# Altium schematic sheet TopSheet.SchDoc
size 431 x 279 mm; SheetNumber: 1; SheetTotal: 4; SheetTitle: Top
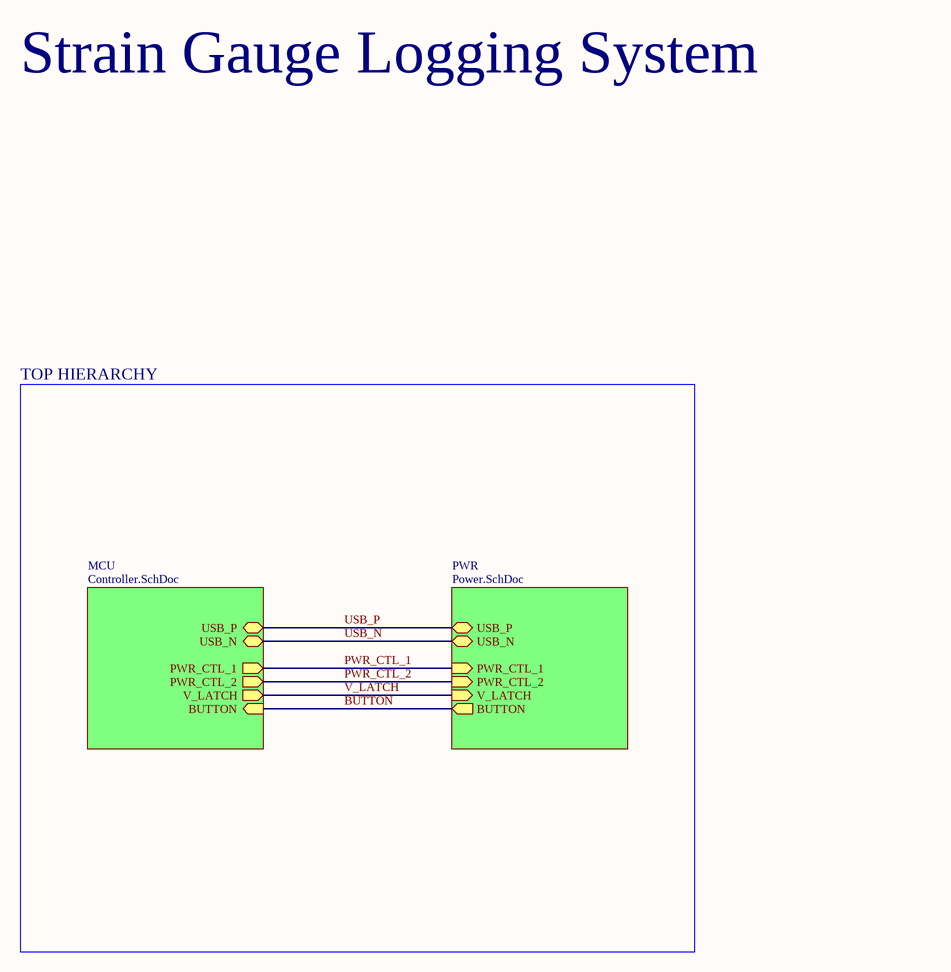
[diagram p0: TopSheet.SchDoc]

## Sub-sheets
MCU = Controller.SchDoc: USB_N (bidir), USB_P (bidir), PWR_CTL_2 (out), PWR_CTL_1 (out), V_LATCH (out), BUTTON (in)
PWR = Power.SchDoc: USB_P (bidir), BUTTON (out), USB_N (bidir), PWR_CTL_1 (in), PWR_CTL_2 (in), V_LATCH (in)

## Nets
BUTTON: sheet MCU/BUTTON, sheet PWR/BUTTON
PWR_CTL_1: sheet MCU/PWR_CTL_1, sheet PWR/PWR_CTL_1
PWR_CTL_2: sheet MCU/PWR_CTL_2, sheet PWR/PWR_CTL_2
USB_N: sheet MCU/USB_N, sheet PWR/USB_N
USB_P: sheet MCU/USB_P, sheet PWR/USB_P
V_LATCH: sheet MCU/V_LATCH, sheet PWR/V_LATCH

## Notes on the sheet
- Strain Gauge Logging System
- TOP HIERARCHY
- Variant name
- Number:
- Date:
- Revision:
- Sheet
- of
- Drawn by
- Verified by: